# Altium schematic sheet TopLevel.SchDoc: Top Level
size A4; Organization: Altium Limited; Address1: L3, 12a Rodborough Rd; Address2: Frenchs Forest; Address3: NSW; Address4: Australia 2086; Revision: 1.0; SheetNumber: 1; SheetTotal: 5; Alumno: Trotta, Ignacio; Curso: R1001; Materia: Sistemas de Representación; Docentes: JM Perdomo, E Ipar
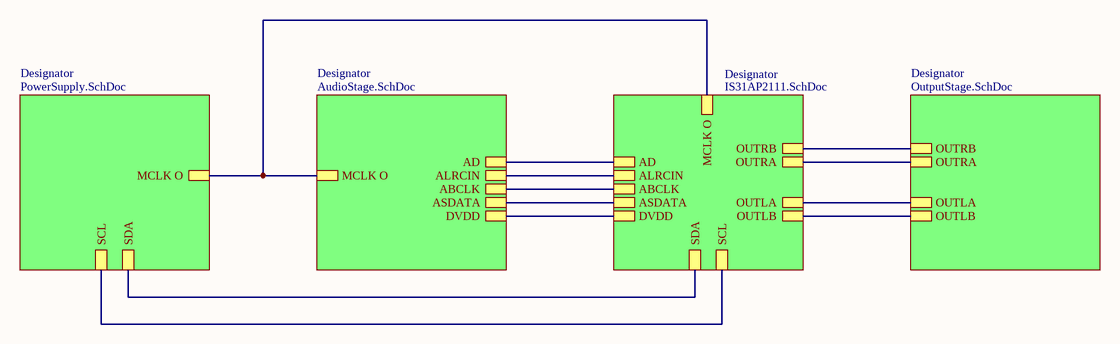
[diagram p0: TopLevel.SchDoc]

## Sub-sheets
Designator = PowerSupply.SchDoc: MCLK O, SDA, SCL
Designator = AudioStage.SchDoc: ASDATA, AD, ALRCIN, ABCLK, MCLK O, DVDD
Designator = IS31AP2111.SchDoc: OUTRB, OUTRA, MCLK O, OUTLA, OUTLB, AD, ALRCIN, ASDATA, DVDD, SDA, SCL, ABCLK
Designator = OutputStage.SchDoc: OUTLB, OUTLA, OUTRB, OUTRA

## Nets
(unnamed): sheet Designator/MCLK O, sheet Designator/MCLK O, sheet Designator/MCLK O
(unnamed): sheet Designator/SDA, sheet Designator/SDA
(unnamed): sheet Designator/SCL, sheet Designator/SCL
(unnamed): sheet Designator/ASDATA, sheet Designator/ASDATA
(unnamed): sheet Designator/AD, sheet Designator/AD
(unnamed): sheet Designator/ALRCIN, sheet Designator/ALRCIN
(unnamed): sheet Designator/ABCLK, sheet Designator/ABCLK
(unnamed): sheet Designator/DVDD, sheet Designator/DVDD
(unnamed): sheet Designator/OUTRB, sheet Designator/OUTRB
(unnamed): sheet Designator/OUTRA, sheet Designator/OUTRA
(unnamed): sheet Designator/OUTLA, sheet Designator/OUTLA
(unnamed): sheet Designator/OUTLB, sheet Designator/OUTLB

## Notes on the sheet
- Title:
- Revision:
- Alumno:
- Materia:
- Docentes:
- Curso:
- File:
- Date:
- Sheet
- of